# Altium schematic sheet 车牌识别.SchDoc
size A4; Organization: Altium Limited; Address1: L3, 12a Rodborough Rd; Address2: Frenchs Forest; Address3: NSW; Address4: Australia 2086
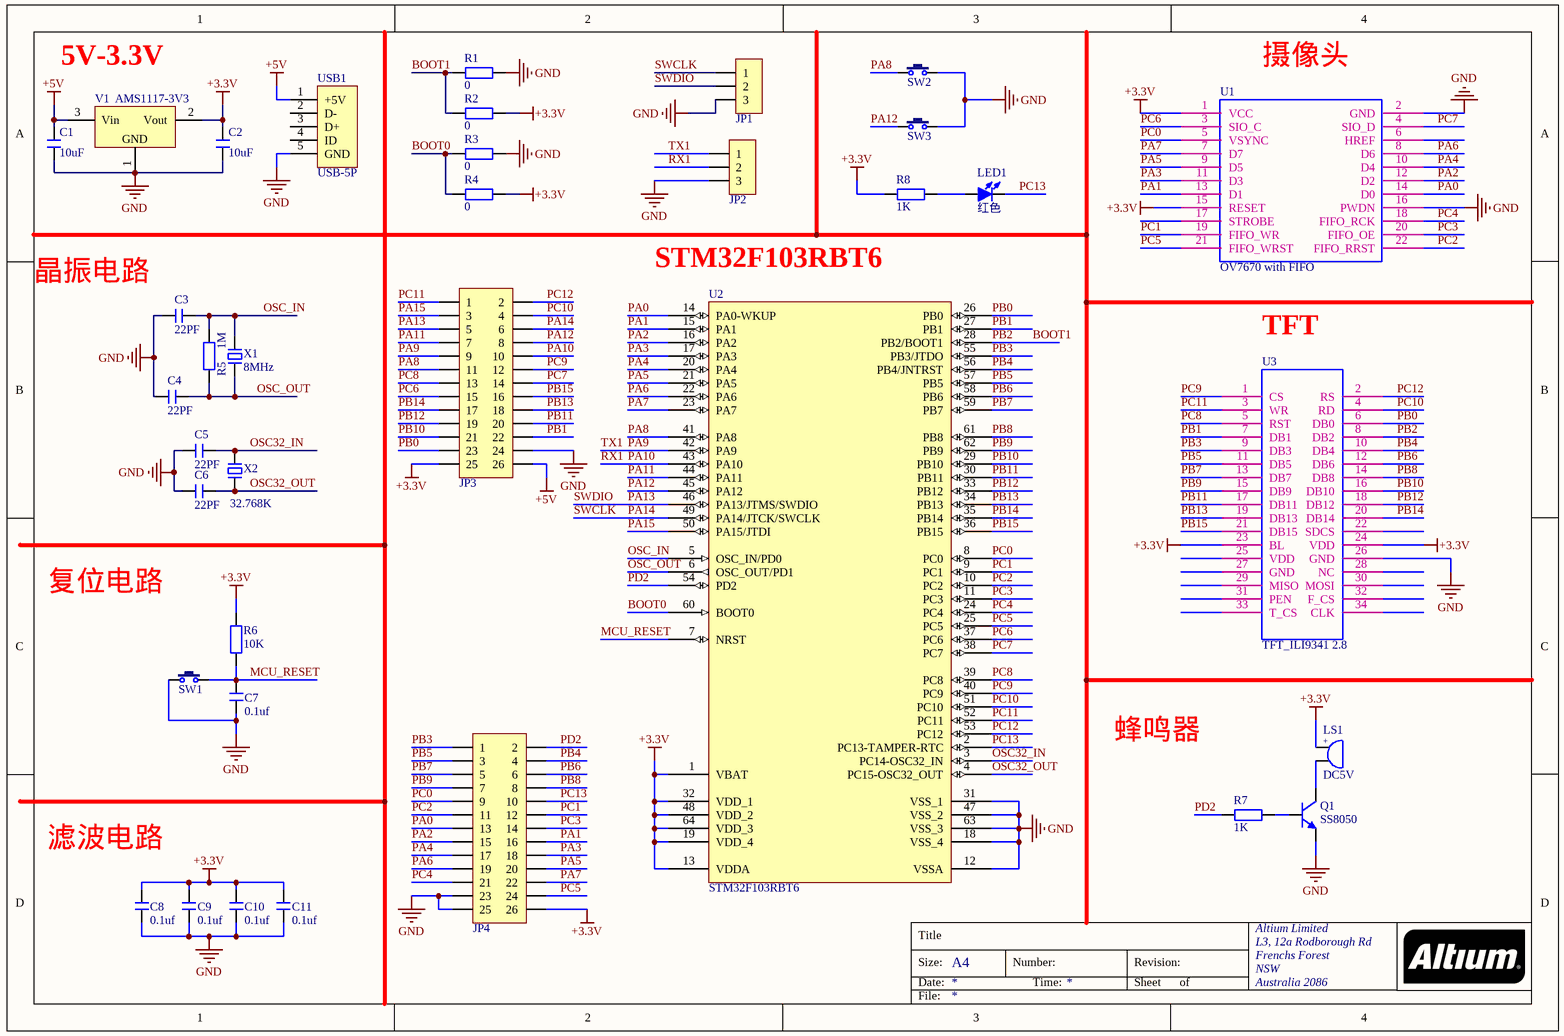
[diagram p0: 车牌识别.SchDoc]

## Parts
C1  10uF  [C 0805_M]
C2  10uF  [C 0805_M]
C3  22PF  [C 0805_M]
C4  22PF  [C 0805_M]
C5  22PF  [C 0805_M]
C6  22PF  [C 0805_M]
C7  0.1uf  [C 0805_M]
C8  0.1uf  [C 0805_M]
C9  0.1uf  [C 0805_M]
C10  0.1uf  [C 0805_M]
C11  0.1uf  [C 0805_M]
JP1  HDR-1X3  [HDR2.54-LI-3P]  (value not drawn)
JP2  HDR-1X3  [HDR2.54-LI-3P]  (value not drawn)
JP3  Header 2X11  [HDR2.54-LI-2x13P]  (value not drawn)
JP4  Header 2X11  [HDR2.54-LI-2x13P]  (value not drawn)
LED1  红色  [LED 0805W]
LS1  DC5V  [BEEP 5x9x5.5]
Q1  SS8050  [SOT23-3M]
R1  0  [R 0805_M]
R2  0  [R 0805_M]
R3  0  [R 0805_M]
R4  0  [R 0805_M]
R5  1M  [R 0805_M]
R6  10K  [R 0805_M]
R7  1K  [R 0805_M]
R8  1K  [R 0805_M]
SW1  3x6x5  [TSW SMD-3*6*2.5]  (value not drawn)
SW2  3x6x5  [TSW SMD-3*6*2.5]  (value not drawn)
SW3  3x6x5  [TSW SMD-3*6*2.5]  (value not drawn)
U1  OV7670 with FIFO  [OV7670模块]
U2  STM32F103RBT6  [LQFP64 10x10_M]
U3  TFT_ILI9341 2.8  [TFT-2.8]
USB1  USB-5P  [USB-MICRO_A]
V1  AMS1117-3V3  [SOT223_M]
X1  8MHz  [OSC HC-49S]
X2  32.768K  [OSC 3215-2P]

## Nets
+3.3V: C2.2 C8.2 C9.2 C10.2 C11.2 JP3.25 JP4.26 LS1.1 R2.2 R4.2 R6.2 R8.2 U1.1(VCC) U1.15(RESET) U2.1(VBAT) U2.13(VDDA) U2.19(VDD_4) U2.32(VDD_1) U2.48(VDD_2) U2.64(VDD_3) U3.23(BL) U3.24(VDD) V1.2(Vout)
+5V: C1.2 JP3.26 USB1.1(+5V) V1.3(Vin)
GND: C1.1 C2.1 C3.1 C4.1 C5.1 C6.1 C7.1 C8.1 C9.1 C10.1 C11.1 JP1.3 JP2.3 JP3.24 JP4.23 JP4.25 Q1.2(E) R1.2 R3.2 SW1.1 SW2.2 SW3.2 U1.2(GND) U1.16(PWDN) U2.12(VSSA) U2.18(VSS_4) U2.31(VSS_1) U2.47(VSS_2) U2.63(VSS_3) U3.26(GND) USB1.5(GND) V1.1(GND)
BOOT0: R3.1 R4.1 U2.60(BOOT0)
BOOT1: R1.1 R2.1 U2.28(PB2/BOOT1) U3.8(DB2)  [also labelled PB2]
MCU_RESET: C7.2 R6.1 SW1.2 U2.7(NRST)
OSC32_IN: C5.2 U2.3(PC14-OSC32_IN) X2.2
OSC32_OUT: C6.2 U2.4(PC15-OSC32_OUT) X2.1
OSC_IN: C3.2 R5.1 U2.5(OSC_IN/PD0) X1.2
OSC_OUT: C4.2 R5.2 U2.6(OSC_OUT/PD1) X1.1
PA0: JP4.13 U1.14(D0) U2.14(PA0-WKUP)
PA1: JP4.16 U1.13(D1) U2.15(PA1)
PA2: JP4.15 U1.12(D2) U2.16(PA2)
PA3: JP4.18 U1.11(D3) U2.17(PA3)
PA4: JP4.17 U1.10(D4) U2.20(PA4)
PA5: JP4.20 U1.9(D5) U2.21(PA5)
PA6: JP4.19 U1.8(D6) U2.22(PA6)
PA7: JP4.22 U1.7(D7) U2.23(PA7)
PA8: JP3.11 SW2.1 U2.41(PA8)
PA9: JP2.1 JP3.9 U2.42(PA9)  [also labelled TX1]
PA10: JP2.2 JP3.10 U2.43(PA10)  [also labelled RX1]
PA11: JP3.7 U2.44(PA11)
PA12: JP3.8 SW3.1 U2.45(PA12)
PA13: JP1.2 JP3.5 U2.46(PA13/JTMS/SWDIO)  [also labelled SWDIO]
PA14: JP1.1 JP3.6 U2.49(PA14/JTCK/SWCLK)  [also labelled SWCLK]
PA15: JP3.3 U2.50(PA15/JTDI)
PB0: JP3.23 U2.26(PB0) U3.6(DB0)
PB1: JP3.22 U2.27(PB1) U3.7(DB1)
PB3: JP4.1 U2.55(PB3/JTDO) U3.9(DB3)
PB4: JP4.4 U2.56(PB4/JNTRST) U3.10(DB4)
PB5: JP4.3 U2.57(PB5) U3.11(DB5)
PB6: JP4.6 U2.58(PB6) U3.12(DB6)
PB7: JP4.5 U2.59(PB7) U3.13(DB7)
PB8: JP4.8 U2.61(PB8) U3.14(DB8)
PB9: JP4.7 U2.62(PB9) U3.15(DB9)
PB10: JP3.21 U2.29(PB10) U3.16(DB10)
PB11: JP3.20 U2.30(PB11) U3.17(DB11)
PB12: JP3.19 U2.33(PB12) U3.18(DB12)
PB13: JP3.18 U2.34(PB13) U3.19(DB13)
PB14: JP3.17 U2.35(PB14) U3.20(DB14)
PB15: JP3.16 U2.36(PB15) U3.21(DB15)
PC0: JP4.9 U1.5(VSYNC) U2.8(PC0)
PC1: JP4.12 U1.19(FIFO_WR) U2.9(PC1)
PC2: JP4.11 U1.22(FIFO_RRST) U2.10(PC2)
PC3: JP4.14 U1.20(FIFO_OE) U2.11(PC3)
PC4: JP4.21 U1.18(FIFO_RCK) U2.24(PC4)
PC5: JP4.24 U1.21(FIFO_WRST) U2.25(PC5)
PC6: JP3.15 U1.3(SIO_C) U2.37(PC6)
PC7: JP3.14 U1.4(SIO_D) U2.38(PC7)
PC8: JP3.13 U2.39(PC8) U3.5(RST)
PC9: JP3.12 U2.40(PC9) U3.1(CS)
PC10: JP3.4 U2.51(PC10) U3.4(RD)
PC11: JP3.1 U2.52(PC11) U3.3(WR)
PC12: JP3.2 U2.53(PC12) U3.2(RS)
PC13: JP4.10 LED1.2(K) U2.2(PC13-TAMPER-RTC)
PD2: JP4.2 R7.2 U2.54(PD2)
NetLED1_1: LED1.1(A) R8.1
NetLS1_2: LS1.2 Q1.3(C)
NetQ1_1: Q1.1(B) R7.1

Not connected (* = marked no-connect by the designer): U1 6(HREF) 17(STROBE); U3 22(SDCS) 25(VDD) 27(GND) 28(NC) 29(MISO) 30(MOSI) 31(PEN) 32(F_CS) 33(T_CS) 34(CLK); USB1 2(D-) 3(D+) 4(ID)

## Notes on the sheet
- 5V-3.3V
- (near U1) 摄像头
- 晶振电路
- STM32F103RBT6
- TFT
- 复位电路
- 蜂鸣器
- 滤波电路
- Title
- Size:
- Date:
- A4
- Number:
- Time:
- Revision:
- Sheet
- of
- File:
- (in symbol BEEP) +

## Library data of the parts
C1-C11 = C: 无极性贴片电容; 版权归属: 源创客; BOM名称: 无极性贴片电容; 学习资源: www.ooocke.com
JP1 JP2 = Header 3: 3P接插件; 版权归属: 源创客; BOM名称: 3P接插件; 学习资源: www.ooocke.com
JP3 JP4 = Header 13X2: 13*2P接插件; 版权归属: 源创客; BOM名称: 13*2P接插件; 学习资源: www.ooocke.com
LED1 = LED-SMD: 贴片LED; 版权归属: 源创客; BOM名称: 贴片LED; 学习资源: www.ooocke.com
LS1 = BEEP: 蜂鸣器; 版权归属: 源创客; BOM名称: 蜂鸣器; 学习资源: www.ooocke.com
Q1 = 8050-SMD: 高频放大-NPN型; 版权归属: 源创客; 属性: 40V 1.5A 1W 100MHZ; BOM名称: 高频放大-NPN型; 学习资源: www.ooocke.com
R1-R8 = R: 贴片电阻; 版权归属: 源创客; BOM名称: 贴片电阻; 学习资源: www.ooocke.com
SW1-SW3 = TSW 3x6: 3x6轻触开关; 版权归属: 源创客; BOM名称: 3x6轻触开关; 学习资源: www.ooocke.com
U1 = OV7670: FIFO; LatestRevisionDate: 17-Jul-2002; LatestRevisionNote: Re-released for DXP Platform.; Publisher: Altium Limited
U2 = STM32F103RCT6
U3 = TFT: ILI9341
USB1 = USB-5P: 微型USB母座; 版权归属: 源创客; BOM名称: 微型USB母座; 学习资源: www.ooocke.com
V1 = AMS1117: 三端稳压芯片; BOM名称: 稳压芯片; 版权归属: 源创客; 学习资源: www.ooocke.com
X1 X2 = XTAL-2P: 2脚无源脚晶振; 版权归属: 源创客; BOM名称: 2脚无源脚晶振; 学习资源: www.ooocke.com